# Altium schematic sheet Microcontroller.SchDoc
size A
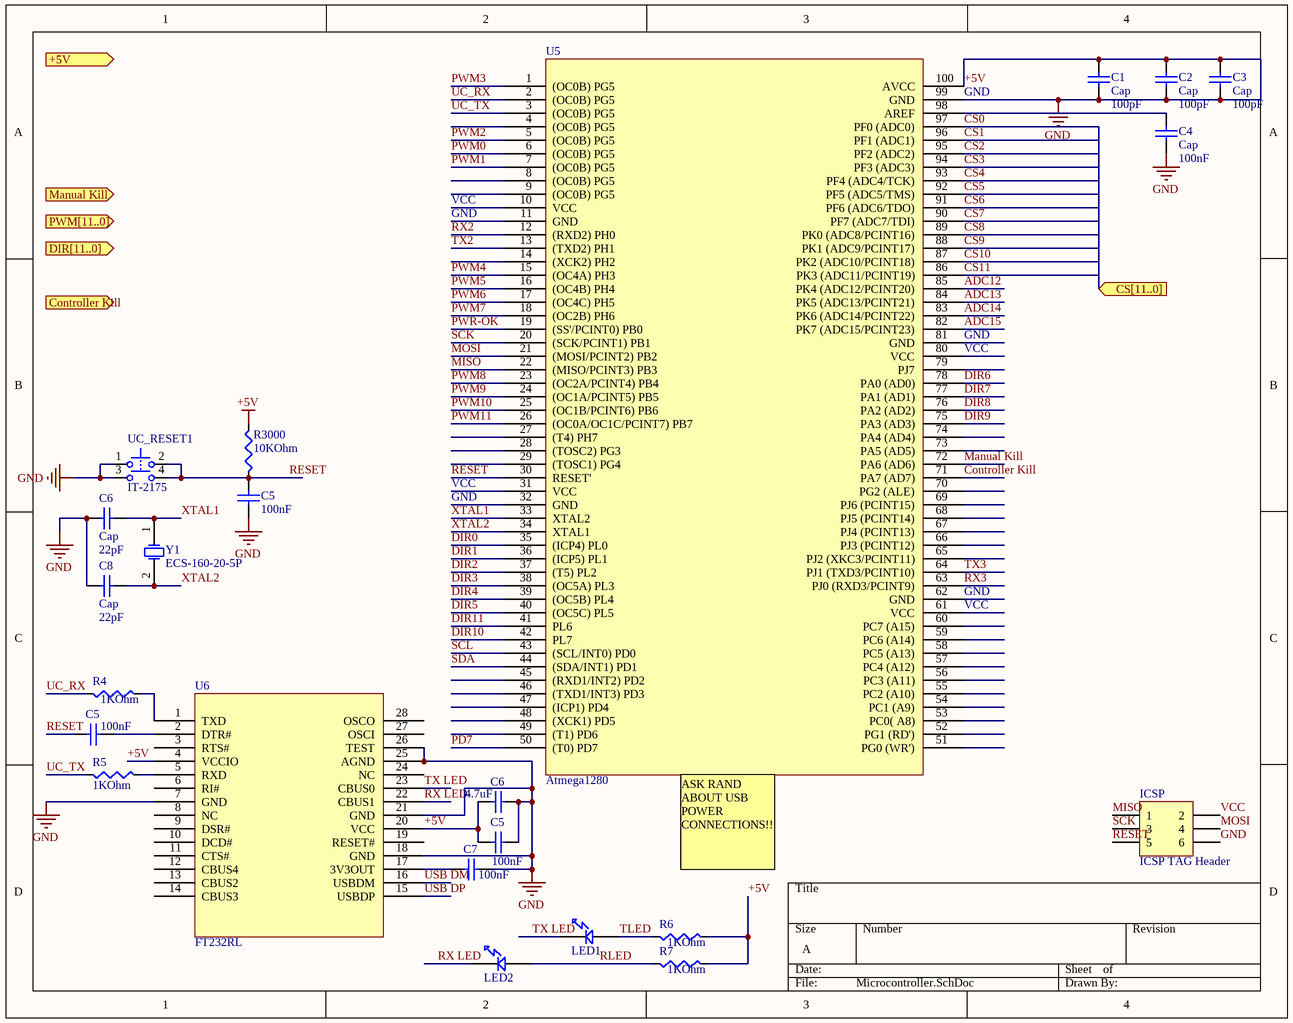
[diagram p0: Microcontroller.SchDoc]

## Parts
(Parts that share a designator on the sheet are numbered #1, #2 ... from top to bottom, then left to right.)
C1  Cap  value 100pF  [0805 (2012) Capacitor]
C2  Cap  value 100pF  [0805 (2012) Capacitor]
C3  Cap  value 100pF  [0805 (2012) Capacitor]
C4  Cap  value 100nF  [0805 (2012) Capacitor]
C5#1  100nF  [0805 (2012) Capacitor]
C5#2  100nF  [0805 (2012) Capacitor]
C5#3  100nF  [0805 (2012) Capacitor]
C6#1  Cap  value 22pF  [0805 (2012) Capacitor]
C6#2  4.7uF  [0805 (2012) Capacitor]
C7  100nF  [0805 (2012) Capacitor]
C8  Cap  value 22pF  [0805 (2012) Capacitor]
ICSP  ICSP TAG Header  [HDR2X3]
LED1  LED  [LED 0805]  (value not drawn)
LED2  LED  [LED 0805]  (value not drawn)
R4  1KOhm  [R 0805 (2012) RESISTOR]
R5  1KOhm  [R 0805 (2012) RESISTOR]
R6  1KOhm  [R 0805 (2012) RESISTOR]
R7  1KOhm  [R 0805 (2012) RESISTOR]
R3000  10KOhm  [R 0805 (2012) RESISTOR]
U5  Atmega1280  [TSQFP50P1600X1600X120-100N]
U6  FT232RL  [SOP65P780X200-28N]
UC_RESET1  IT-2175  [IT-2175]
Y1  ECS-160-20-5P  [CSM-7]

## Ports
+5V (in), Controller Kill (out), CS[11..0] (in), DIR[11..0] (out), Manual Kill (in), PWM[11..0] (out)

## Nets
+5V: C1.1 C1.2 C2.1 C2.2 C3.1 C3.2 C4.1 C5#1.1 C5#3.1 C5#3.2 C6#1.1 C6#2.1 C6#2.2 C7.2 C8.1 ICSP.6 R6.2 R7.2 R3000.1 U5.11(GND) U5.32(GND) U5.62(GND) U5.81(GND) U5.99(GND) U5.100(AVCC) U6.4(VCCIO) U6.7(GND) U6.18(GND) U6.20(VCC) U6.21(GND) U6.25(AGND) U6.26(TEST) UC_RESET1.1 UC_RESET1.3  [also labelled GND]
ADC12: U5.85(PK4_(ADC12/PCINT20))
ADC13: U5.84(PK5_(ADC13/PCINT21))
ADC14: U5.83(PK6_(ADC14/PCINT22))
ADC15: U5.82(PK7_(ADC15/PCINT23))
Controller Kill: U5.71(PA7_(AD7))
CS0: U5.97(PF0_(ADC0))
CS1: U5.96(PF1_(ADC1))
CS2: U5.95(PF2_(ADC2))
CS3: U5.94(PF3_(ADC3))
CS4: U5.93(PF4_(ADC4/TCK))
CS5: U5.92(PF5_(ADC5/TMS))
CS6: U5.91(PF6_(ADC6/TDO))
CS7: U5.90(PF7_(ADC7/TDI))
CS8: U5.89(PK0_(ADC8/PCINT16))
CS9: U5.88(PK1_(ADC9/PCINT17))
CS10: U5.87(PK2_(ADC10/PCINT18))
CS11: U5.86(PK3_(ADC11/PCINT19))
DIR0: U5.35((ICP4)_PL0)
DIR1: U5.36((ICP5)_PL1)
DIR2: U5.37((T5)_PL2)
DIR3: U5.38((OC5A)_PL3)
DIR4: U5.39((OC5B)_PL4)
DIR5: U5.40((OC5C)_PL5)
DIR6: U5.78(PA0_(AD0))
DIR7: U5.77(PA1_(AD1))
DIR8: U5.76(PA2_(AD2))
DIR9: U5.75(PA3_(AD3))
DIR10: U5.42(PL7)
DIR11: U5.41(PL6)
Manual Kill: U5.72(PA6_(AD6))
MISO: ICSP.1 U5.22((MISO/PCINT3)_PB3)
MOSI: ICSP.4 U5.21((MOSI/PCINT2)_PB2)
PD7: U5.50((T0)_PD7)
PWM0: U5.6((OC0B)_PG5)
PWM1: U5.7((OC0B)_PG5)
PWM2: U5.5((OC0B)_PG5)
PWM3: U5.1((OC0B)_PG5)
PWM4: U5.15((OC4A)_PH3)
PWM5: U5.16((OC4B)_PH4)
PWM6: U5.17((OC4C)_PH5)
PWM7: U5.18((OC2B)_PH6)
PWM8: U5.23((OC2A/PCINT4)_PB4)
PWM9: U5.24((OC1A/PCINT5)_PB5)
PWM10: U5.25((OC1B/PCINT6)_PB6)
PWM11: U5.26((OC0A/OC1C/PCINT7)_PB7)
PWR-OK: U5.19((SS'/PCINT0)_PB0)
RESET: C5#1.2 C5#2.1 ICSP.5 R3000.2 U5.30(RESET') UC_RESET1.2 UC_RESET1.4
RLED: LED2.2 R7.1
RX2: U5.12((RXD2)_PH0)
RX3: U5.63(PJ0_(RXD3/PCINT9))
RX LED: LED2.1 U6.22(CBUS1)
SCK: ICSP.3 U5.20((SCK/PCINT1)_PB1)
SCL: U5.43((SCL/INT0)_PD0)
SDA: U5.44((SDA/INT1)_PD1)
TLED: LED1.2 R6.1
TX2: U5.13((TXD2)_PH1)
TX3: U5.64(PJ1_(TXD3/PCINT10))
TX LED: LED1.1 U6.23(CBUS0)
UC_RX: R4.1 U5.2((OC0B)_PG5)
UC_TX: R5.1 U5.3((OC0B)_PG5)
USB DM: U6.16(USBDM)
USB DP: U6.15(USBDP)
VCC: ICSP.2 U5.10(VCC) U5.31(VCC) U5.61(VCC) U5.80(VCC)
XTAL1: C6#1.2 U5.33(XTAL2) Y1.1(OSC1)
XTAL2: C8.2 U5.34(XTAL1) Y1.2(OSC2)
NetC4_2: C4.2 U5.98(AREF)
NetC5#2_2: C5#2.2 U6.2(DTR#)
NetC7_1: C7.1 U6.17(3V3OUT)
NetR4_2: R4.2 U6.1(TXD)
NetR5_2: R5.2 U6.5(RXD)

Not connected (* = marked no-connect by the designer): U5 4((OC0B)_PG5) 8((OC0B)_PG5) 9((OC0B)_PG5) 14((XCK2)_PH2) 27((T4)_PH7) 28((TOSC2)_PG3) 29((TOSC1)_PG4) 45((RXD1/INT2)_PD2) 46((TXD1/INT3)_PD3) 47((ICP1)_PD4) 48((XCK1)_PD5) 49((T1)_PD6) 51(PG0_(WR')) 52(PG1_(RD')) 53(PC0(_A8)) 54(PC1_(A9)) 55(PC2_(A10)) 56(PC3_(A11)) 57(PC4_(A12)) 58(PC5_(A13)) 59(PC6_(A14)) 60(PC7_(A15)) 65(PJ2_(XKC3/PCINT11)) 66(PJ3_(PCINT12)) 67(PJ4_(PCINT13)) 68(PJ5_(PCINT14)) 69(PJ6_(PCINT15)) 70(PG2_(ALE)) 73(PA5_(AD5)) 74(PA4_(AD4)) 79(PJ7); U6 3(RTS#) 6(RI#) 8(NC) 9(DSR#) 10(DCD#) 11(CTS#) 12(CBUS4) 13(CBUS2) 14(CBUS3) 19(RESET#) 24(NC) 27(OSCI) 28(OSCO)

## Notes on the sheet
- (near U5) ASK RAND ABOUT USB POWER CONNECTIONS!!

## Library data of the parts
C1-C4 C6#1 C8 = Cap: Capacitor; Published: 8-Jun-2000; LatestRevisionDate: 17-Jul-2002; LatestRevisionNote: Re-released for DXP Platform.; PackageReference: RAD-0.3; Publisher: Altium Limited
C5#1-C5#3 C6#2 C7 = Capacitor (non-polarized): Capacitor; Value: .1uF
ICSP = Header 3X2: Header, 3-Pin, Dual row; LatestRevisionDate: 17-Jul-2002; LatestRevisionNote: Re-released for DXP Platform.; Publisher: Altium Limited
LED1 LED2 = LED: Standard LED
R4-R7 R3000 = Resistor: Value: 0Ohm
UC_RESET1 = IT-2175: Tactile Switch, DPST; Thru-Hole; Vertical; Rating DC 12V, 50mA (max); PackageDocument: Rev.0; Published: 6-Jun-2005; DatasheetDocument: Rev.0; PackageReference: IT-2175; Publisher: Altium Limited; ComponentLink1Description: Manufacturer Link; ComponentLink1URL: http://www.ilswitch.com/; ComponentLink2Description: Device Overview; ComponentLink2URL: http://www.ilswitch.com/list.php?ac_id=010112&ai_id=91
Y1 = ECS-120-32-1: Crystal Oscillator; Published: 17-Jul-2002; DatasheetDocument: 18-Apr-2000; PackageReference: HC-49U; Publisher: Altium Limited; ComponentLink1Description: Manufacturer Link; ComponentLink1URL: http://www.ecsxtal.com/; ComponentLink2Description: Datasheet; ComponentLink2URL: http://www.ecsxtal.com/pdf2/HC49U.PDF